# Altium schematic sheet STeaMi-FP10-Sortie_Audio.SchDoc
size A3; DocumentNumber: 1; SheetNumber: 11; SheetTotal: 16
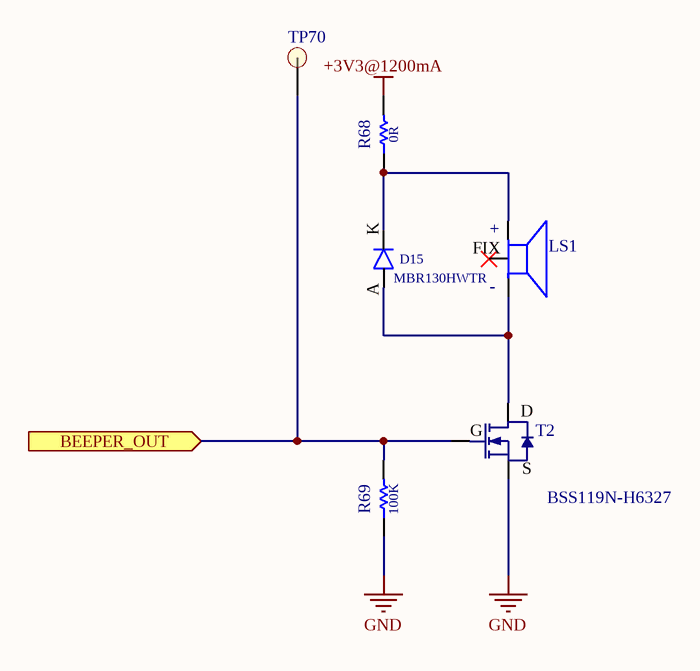
[diagram p0: STeaMi-FP10-Sortie_Audio.SchDoc]

## Parts
D15  Part Number: MBR130HWTR  [SOD3615X145N_SOD123]
LS1  (no value)  [XDCR_SMT-0825-S-HT-R]
R68  Resistance: 0R  [RESC1005X40N_0402]
R69  Resistance: 100K  [RESC1005X40N_0402]
T2  Manufacturer Part Number: BSS119N-H6327  [SOT95P260X110-3N_SOT-23-3]
TP70  PAD  [Testpoint 1mm]  (value not drawn)  (no BOM)

## Ports
BEEPER_OUT (in)

## Nets
+3V3@1200mA: R68.2
GND: R69.1 T2.2(SOURCE)
BEEPER_OUT: R69.2 T2.1(GATE) TP70.1 ; port BEEPER_OUT
NetD15_A: D15.A LS1.N(NEG) T2.3(DRAIN)
NetD15_K: D15.K LS1.P(POS) R68.1

Not connected (* = marked no-connect by the designer): LS1 FIX*

## Notes on the sheet
- Le présent document est la propriété exclusive de SmartEmbed. Remis à titre confidentiel, il ne peut être communiqué
- IND
- DATE
- DESCRIPTION
- VISA
- à des tiers, ni utilisé ou reproduit qu'en stricte conformité d'autorisations expresses préalables.
- Etabli le:
- Verifié le:
- Validé le:
- Par:
- Page:
- /
- Pépinière CleanTech Domaine du Petit Arbois Avenue Louis Philibert BP 80058 13792 AIX-EN-PROVENCE CEDEX 3
- REFERENCE
- DESIGNATION
- (in symbol BSS119N) D; G; S
- (in symbol SMT-0825-S-HT-R) +; -

## Library data of the parts
D15 = MBR130HWTR: Diode Schottky 30 V 1A Montage en surface SOD-123; Manufacturer: SMC diode solutions; Populated: True; Switch possibility: False; Voltage: 30V; Vérification: Non; Created by: EAG; Creation Date: 18/12/2021; Manufacturer Part Number: MBR130HWTR; Digikey: 1655-1437-1-ND
LS1 = SMT-0825-S-HT-R: Speakers & Transducers SURFACE MOUNT TRANSDUCER 3.6 VP-P; Manufacturer: PUI Audio Inc; Populated: False; Switch possibility: False; Vérification: Non; Created by: EAG; Creation Date: 15/09/2021; Checked by: *; Ambient Temperature: ='Ambient temp'; Storage temperature: ='Storage temp'; AEC: ='AEC'; Current: *; RoHs compliant: ='Rohs'; Datasheet: ='Datasheet'; Part Number: SMT-0825-S-HT-R; Digikey: 668-SMT-0825-S-HT-RCT-ND; Manufacturer Part Number: SMT-0825-S-HT-R; Mouser: 665-SMT0825SHTR
R68 = 0R-5%-0,0625W-0402: RES CMS 0R5%-0,0625W-0402; Manufacturer: Yageo; Manufacturer Part Number: RC0402JR-100RL; Populated: True; Power: 0,0625; Nom vérificateur: Non; Prix: 0,09; std Package: 0402; Tolerence: 0,05; Created by: EAG; Creation Date: 02/12/2021; Part Number: 0R-5%-0,0625W-0402; Mouser: 603-RC0402JR-100RL; Switch possibility: True
R69 = 100K-5%-0,0625W-0402: RES CMS 100K5%-0,0625W-0402 ±100ppm/°C; Manufacturer: Yageo; Manufacturer Part Number: RC0402JR-07100KL; Populated: True; Power: 0,0625; Nom vérificateur: Non; Prix: 0,09; std Package: 0402; Tolerence: 0,05; Created by: EAG; Creation Date: 02/12/2021; Part Number: 100K-5%-0,0625W-0402; Digikey: 311-100KJRCT-ND; Farnell: 9233008; Switch possibility: True
T2 = BSS119N: Small-Signal-Transitor MOSFET N; Manufacturer: Infineon; Populated: False; Switch possibility: False; Vérification: Oui; Checked by: MSA; Created by: EAG; Creation Date: 16/08/2018; ComponentLink1Description: Datasheet; ComponentLink1URL: https://www.infineon.com/dgdl/Infineon-BSS119N-DS-v02_01-en.pdf?fileId=db3a304335f1f4b6013639b6532a164a; Part Number: BSS119N; Digikey: BSS119NH6327XTSA1CT-ND; Farnell: -; Mouser: 726-BSS119NH6327; RS: -
TP70 = TESTPOINTPAD: Manufacturer: SmartEmbed; Package: PAD_TEST; Part Number: TESTPOINTPAD